# Altium schematic sheet CAN.SchDoc
size A4
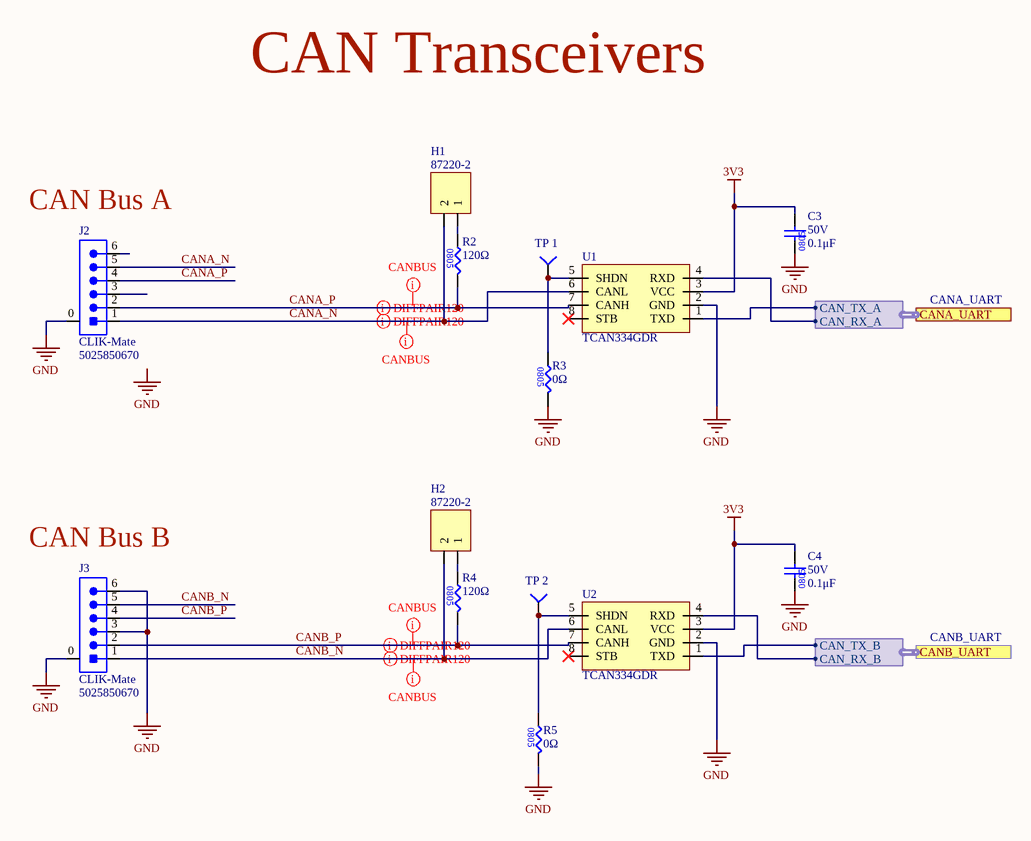
[diagram p0: CAN.SchDoc]

## Parts
C3  value 0.1μF  Voltage Rating: 50V  [CAP2012]  (hidden comment: CAP_0.1uF_50V_0805)
C4  value 0.1μF  Voltage Rating: 50V  [CAP2012]  (hidden comment: CAP_0.1uF_50V_0805)
H1  Manufacturer Part Number 1: 87220-2  [HDR1X2]  (hidden comment: JUMPER_2)
H2  Manufacturer Part Number 1: 87220-2  [HDR1X2]  (hidden comment: JUMPER_2)
J2  Family: CLIK-Mate  Manufacturer Part Number 1: 5025850670  [MOLEX-5025850670]  (hidden comment: CON_6M_SM_RA_1.5mm)
J3  Family: CLIK-Mate  Manufacturer Part Number 1: 5025850670  [MOLEX-5025850670]  (hidden comment: CON_6M_SM_RA_1.5mm)
R2  value 120Ω  [RES0805]  (hidden comment: RES_120Ω_0805_1%)
R3  value 0Ω  [RES0805]  (hidden comment: RES_0Ω_0805)
R4  value 120Ω  [RES0805]  (hidden comment: RES_120Ω_0805_1%)
R5  value 0Ω  [RES0805]  (hidden comment: RES_0Ω_0805)
TP_1  TESTPOINT_1MM_CIRCLE  [TESTPOINT_CIRCLE_1MM]  (value not drawn)  (no BOM)
TP_2  TESTPOINT_1MM_CIRCLE  [TESTPOINT_CIRCLE_1MM]  (value not drawn)  (no BOM)
U1  Manufacturer Part Number 1: TCAN334GDR  [SOIC127P600X175-8N]  (hidden comment: IC_CAN_TRANSCEIVER)
U2  Manufacturer Part Number 1: TCAN334GDR  [SOIC127P600X175-8N]  (hidden comment: IC_CAN_TRANSCEIVER)

## Ports
CANA_UART (harness CANA_UART), CANB_UART (harness CANB_UART)

## Harnesses
CANA_UART: CAN_RX_A, CAN_TX_A
CANB_UART: CAN_RX_B, CAN_TX_B

## Nets
3V3: C3.2 C4.2 U1.3(VCC) U2.3(VCC)
GND: C3.1 C4.1 J2.0 J3.0 J3.3 J3.6 R3.2 R5.2 U1.2(GND) U2.2(GND)
CANA_N: H1.2 J2.1 J2.5 U1.6(CANL)
CANA_P: J2.2 J2.4 R2.2 U1.7(CANH)
CANB_N: H2.2 J3.1 J3.5 U2.6(CANL)
CANB_P: J3.2 J3.4 R4.2 U2.7(CANH)
NetH1_1: H1.1 R2.1
NetH2_1: H2.1 R4.1
NetR3_1: R3.1 TP_1.1(=value) U1.5(SHDN)
NetR5_1: R5.1 TP_2.1(=value) U2.5(SHDN)
NetU1_1: U1.1(TXD) ; port CANA_UART.CAN_TX_A
NetU1_4: U1.4(RXD) ; port CANA_UART.CAN_RX_A
NetU2_1: U2.1(TXD) ; port CANB_UART.CAN_TX_B
NetU2_4: U2.4(RXD) ; port CANB_UART.CAN_RX_B

Not connected (* = marked no-connect by the designer): J2 3 6; U1 8(STB)*; U2 8(STB)*

## Layout directives
differential pair; differential pair class CANBUS120: CANA_N, CANA_P, CANB_N, CANB_P
mark named CANBUS: (no net found under the mark), CANA_N, CANB_N, CANB_P

## Notes on the sheet
- CAN Transceivers
- (near J2) CAN Bus A
- (near J3) CAN Bus B
- Labels drawn without touching a wire or pin: GND

## Library data of the parts
C3 C4 = CAP_0.1uF_50V_0805: CAP CER 0.1UF 50V X7R 0805; Manufacturer Part Number 1: GCM21BR71H104KA37K; Manufacturer 1: Murata Electronics; Package/Footprint: 0805; Supplier Part Number 1: 490-8049-1-ND; Supplier 1: Digi-Key; Dielectric: X7R; LCSC Part #: C49678; Mounting Type: SMD
H1 H2 = JUMPER_2: HEADER 2X1; Manufacturer 1: TE Connectivity; Package/Footprint: TH; Supplier 1: Digi-Key; Supplier Part Number 1: A26542-ND; Mount: Through Hole; Mounting Type: TH
J2 J3 = CON_6M_SM_RA_1.5mm: CONN HEADER SMD RIGHT ANGLE 1.5 MM PITCH; Manufacturer 1: Molex; Supplier 1: Digi-Key; Supplier Part Number 1: WM12832CT-ND; Package/Footprint: SMD; Mounting Type: SMD
R2 R4 = RES_120Ω_0805_1%: RES 120 OHM 1% 1/8W 0805; Manufacturer 1: Vishay; Manufacturer Part Number 1: CRCW0805120RFKEA; Package/Footprint: 0805; Supplier Part Number 1: 541-120CCT-ND; Supplier 1: Digi-Key; LCSC Part #: C17437; Mounting Type: SMD
R3 R5 = RES_0Ω_0805: RES 0 OHM JUMPER 1/8W 0805; Manufacturer 1: Panasonic Electronic Components; Manufacturer Part Number 1: ERJ-6GEY0R00V; Package/Footprint: 0805; Supplier Part Number 1: P0.0ACT-ND; Supplier 1: Digi-Key; LCSC Part #: C17477; Mounting Type: SMD
TP_1 TP_2 = TESTPOINT_1MM_CIRCLE: TESTPOINT 1MM CIRCLE
U1 U2 = IC_CAN_TRANSCEIVER: IC TRANSCEIVER 1/1 8SOIC; Manufacturer 1: Maxim; Package/Footprint: 14-SOIC; Mounting Type: SMD; Supplier 1: Digi-Key; Supplier Part Number 1: 296-49940-1-ND